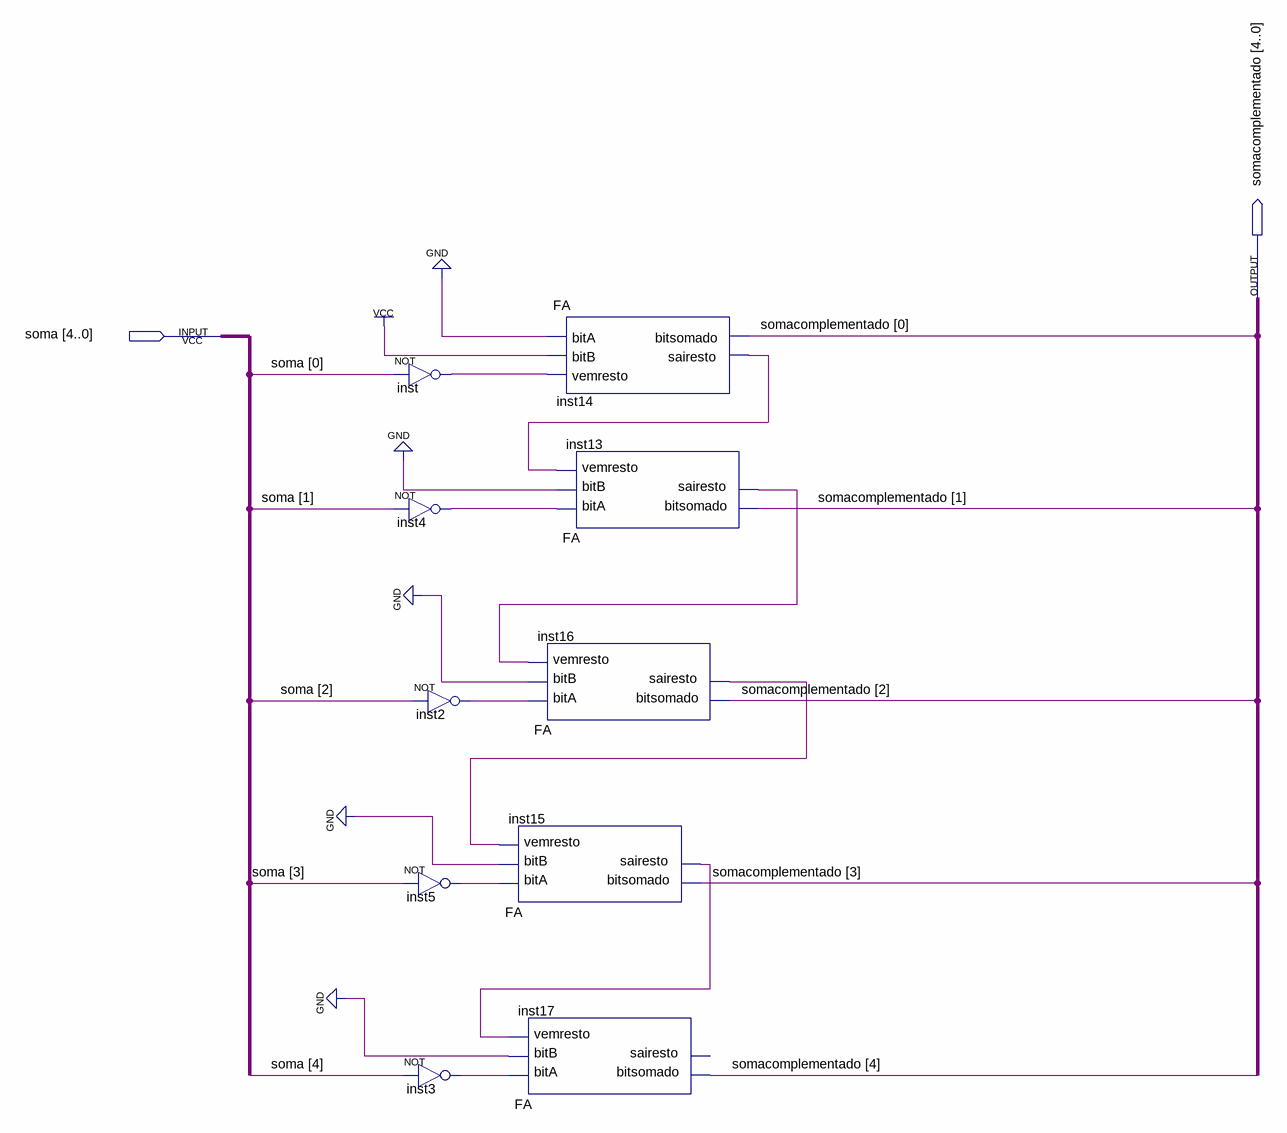
[diagram p0: schematic sheet]
// Quartus schematic complementoa2.bdf as structural Verilog: 10 symbols, 2 pins
module complementoa2 (
  input  [4:0] soma,
  output [4:0] somacomplementado
);

  wire inst2_out, inst3_out, inst4_out, inst5_out, inst13_sairesto, inst14_sairesto, inst15_sairesto,
       inst16_sairesto, inst_out;

  not inst (inst_out, soma[0]);
  not inst4 (inst4_out, soma[1]);
  not inst2 (inst2_out, soma[2]);
  not inst5 (inst5_out, soma[3]);
  not inst3 (inst3_out, soma[4]);
  FA inst15 (
    .bitA(inst5_out), .bitB(1'b0), .vemresto(inst16_sairesto), .bitsomado(somacomplementado[3]),
    .sairesto(inst15_sairesto));
  FA inst17 (
    .bitA(inst3_out), .bitB(1'b0), .vemresto(inst15_sairesto), .bitsomado(somacomplementado[4]));  // open: sairesto
  FA inst14 (
    .bitA(1'b0), .bitB(1'b1), .vemresto(inst_out), .bitsomado(somacomplementado[0]),
    .sairesto(inst14_sairesto));
  FA inst13 (
    .bitA(inst4_out), .bitB(1'b0), .vemresto(inst14_sairesto), .bitsomado(somacomplementado[1]),
    .sairesto(inst13_sairesto));
  FA inst16 (
    .bitA(inst2_out), .bitB(1'b0), .vemresto(inst13_sairesto), .bitsomado(somacomplementado[2]),
    .sairesto(inst16_sairesto));
endmodule
